# EAGLE design seismometer_sensormodule (EAGLE 7.0.0)
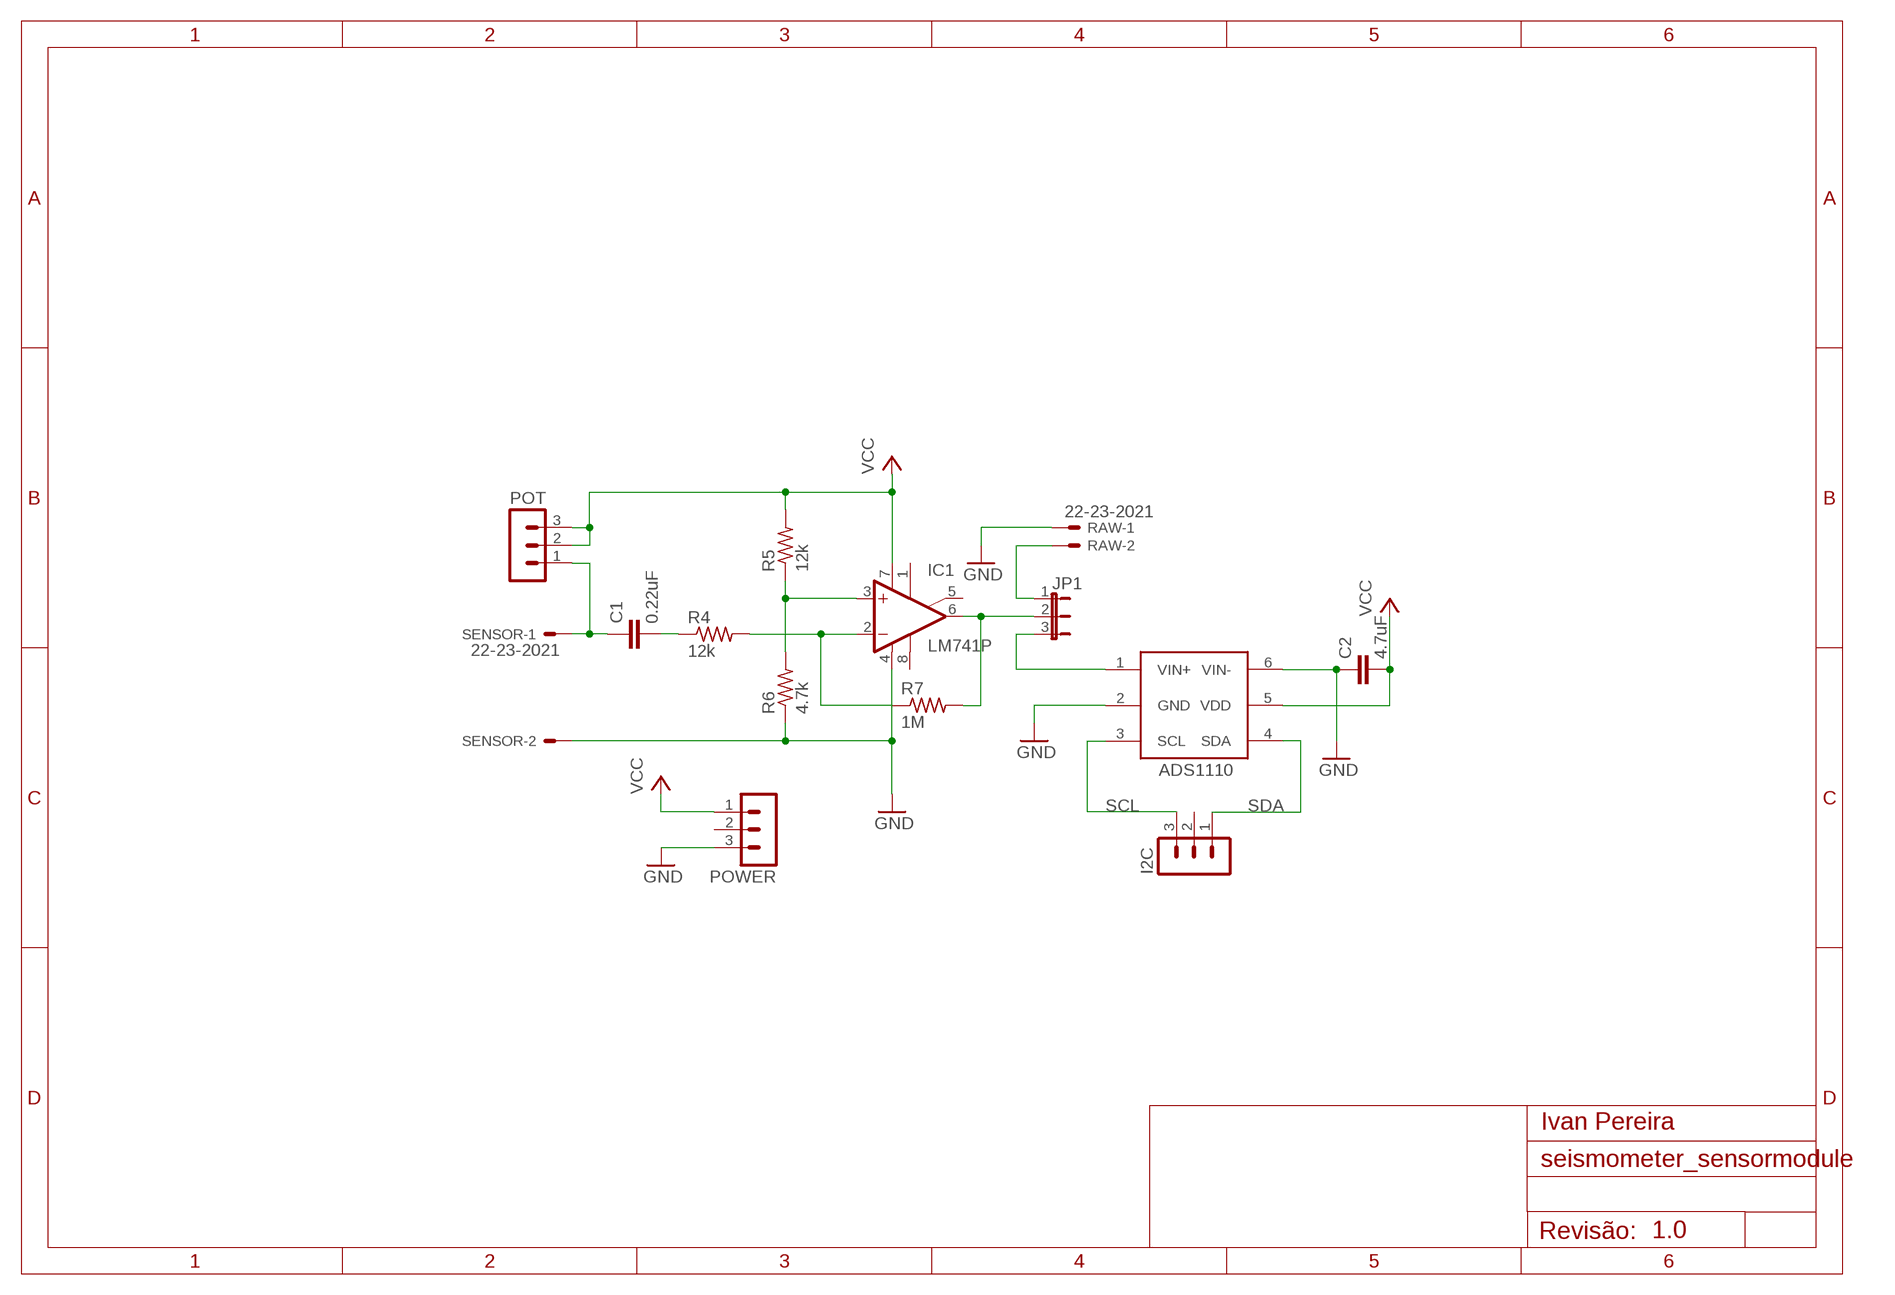
[diagram p0: schematic, sheet 1]
FRAME1 (A4L-LOC): AUTHOR: Ivan Pereira; REV: 1.0

## Parts
C1  0.22uF  C-EU025-030X050  [C025-030X050]
C2  4.7uF  C-EU025-030X050  [C025-030X050]
I2C  MA03-1  [MA03-1]
IC1  LM741P  [DIL08]
IC2  ADS1110  [SOT-23-6]
JP1  JP2E  [JP2]
POT  MA03-1  [MA03-1]
POWER  MA03-1  [MA03-1]
R4  12k  R-US_0207/12  [0207/12]
R5  12k  R-US_0207/12  [0207/12]
R6  4.7k  R-US_0207/12  [0207/12]
R7  1M  R-US_0207/12  [0207/12]
RAW  22-23-2021  [22-23-2021]
SENSOR  22-23-2021  [22-23-2021]

## Nets
GND: C2.1 IC1.4(V-) IC2.2(GND) IC2.6(VIN-) POWER.3 R6.1 RAW.1 SENSOR.2
N$1: IC2.1(VIN+) JP1.3
N$2: C1.2 R4.1
N$3: IC1.2(-IN) R4.2 R7.1
N$4: JP1.1 RAW.2
N$5: IC1.3(+IN) R5.1 R6.2
N$8: C1.1 POT.1 SENSOR.1
N$9: IC1.6(OUT) JP1.2 R7.2
SCL: I2C.3 IC2.3(SCL)
SDA: I2C.1 IC2.4(SDA)
VCC: C2.2 IC1.7(V+) IC2.5(VDD) POT.2 POT.3 POWER.1 R5.2
Unconnected: I2C.2 IC1.1(ON1) IC1.5(ON2) IC1.8(OPT) POWER.2

## Library data of the parts
C1 C2 = rcl:C-EU: CAPACITOR, European symbol
I2C POT POWER = con-lstb:MA03-1: PIN HEADER; OC_FARNELL: unknown; OC_NEWARK: unknown
IC1 = linear:*741: OP AMP
IC2 = ads11xx:ADS1110: Analog/Digital conventer i2c Bus max: 2.048v
JP1 = jumper:JP2E: JUMPER
R4-R7 = resistor:R-US_: RESISTOR, American symbol
RAW SENSOR = con-molex:22-23-2021: .100" (2.54mm) Center Header - 2 Pin; MF: MOLEX; MPN: 22-23-2021; OC_FARNELL: 1462926; OC_NEWARK: 25C3832

## Board
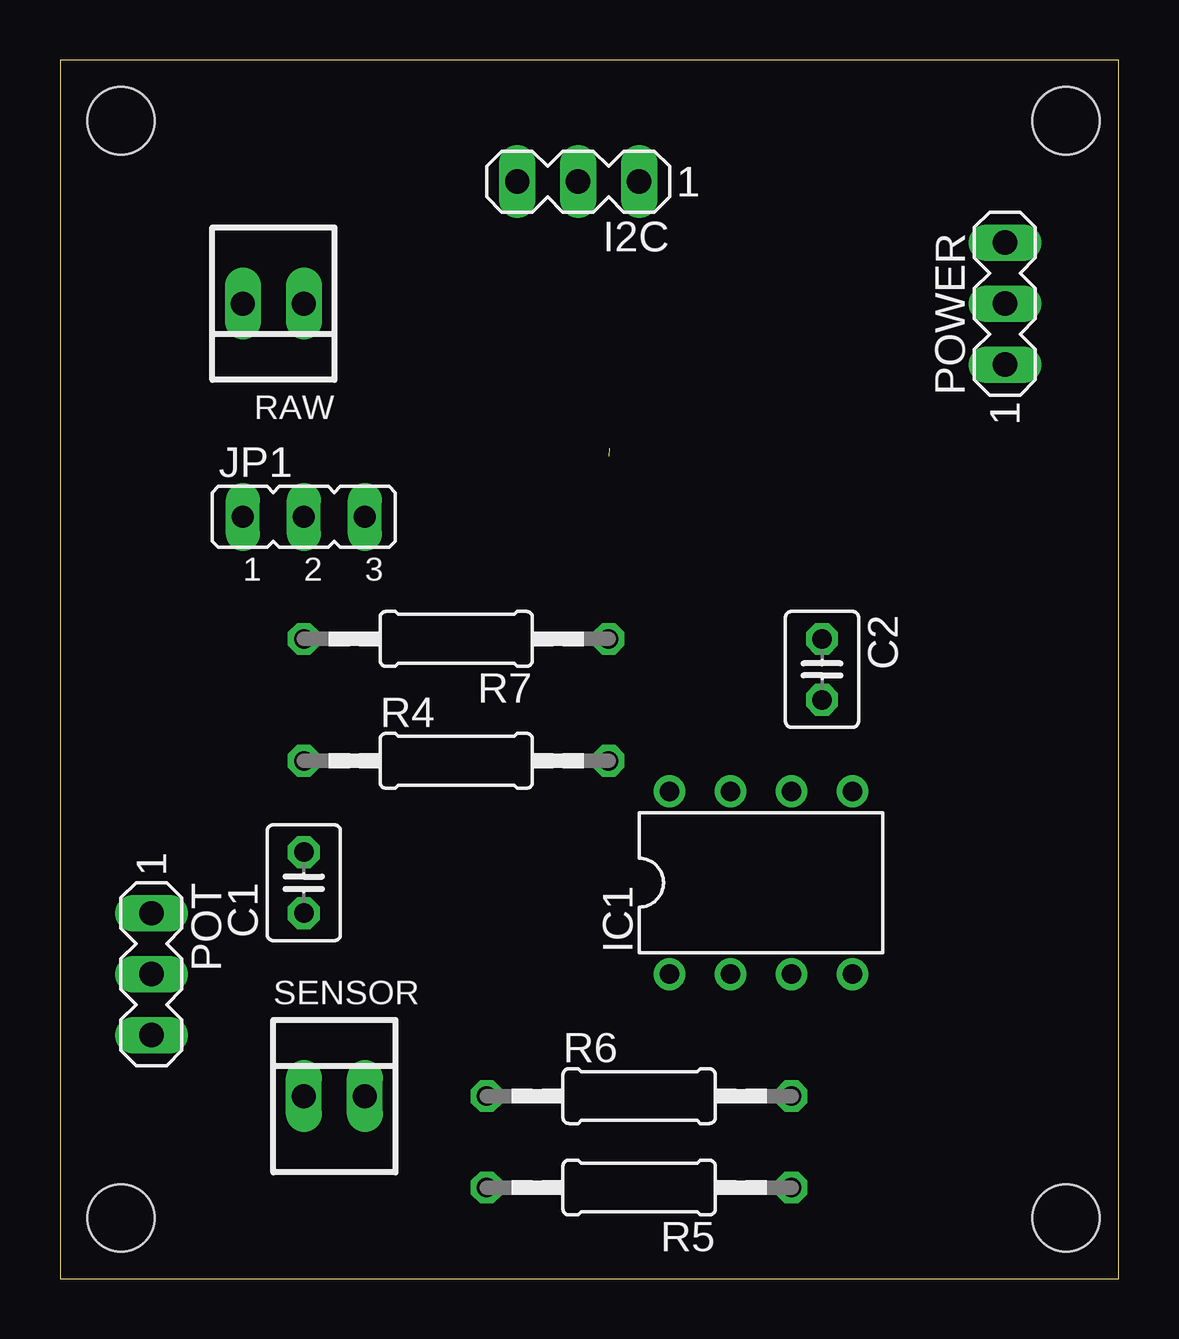
[diagram p1: board, top side]
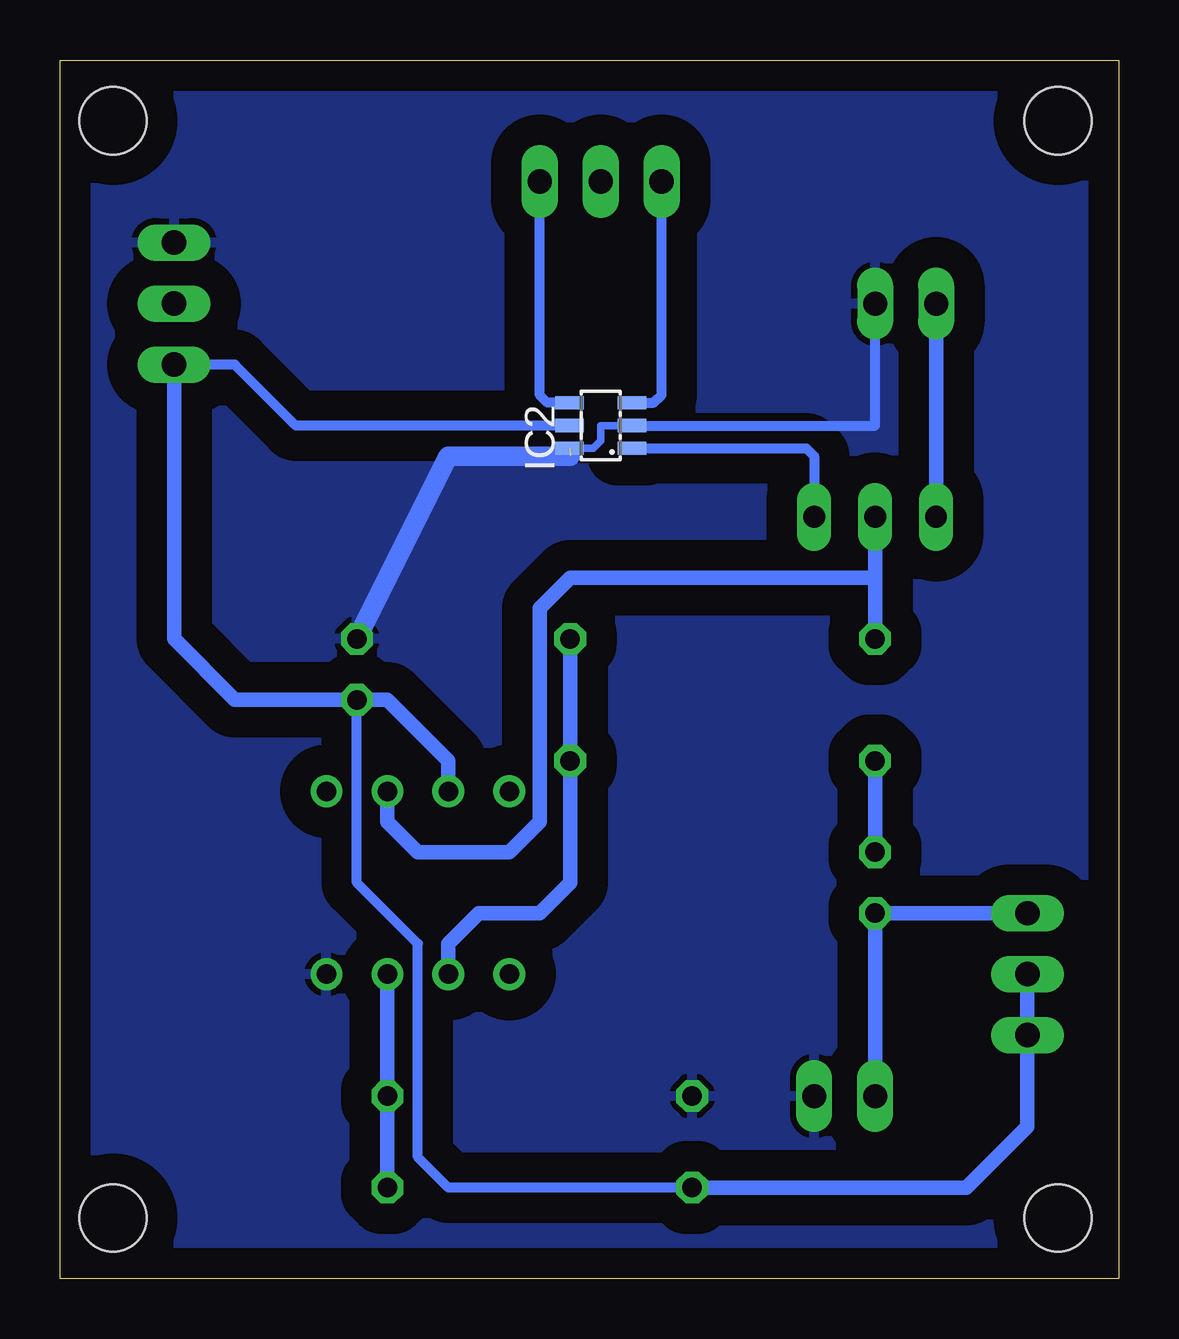
[diagram p2: board, bottom side, seen from below]

Size 44.12 x 50.79 mm. Coordinates in mm from the lower left corner, seen from the top.
Outline: 0,0 44.12,0 44.12,50.79 0,50.79 0,0
Copper layers (1*16): Top 0.035mm / dielectric 1.5mm / Bottom 0.035mm
Design rules "default": minimum track width 10mil, minimum drill 24mil, track to track 8mil, track to pad 8mil, pad to pad 8mil, via to via 8mil, smd to smd 8mil, copper to edge 40mil, drill to drill 8mil, minimum pad ring 10mil, minimum via ring 8mil, stop-mask expansion 4mil, vias tented up to drill 0mil, thermal gap 10mil
Holes 2.8 mm at 2.54,2.54 41.91,2.54 41.91,48.26 2.54,48.26

### Footprints (pad centres in the part's own frame; a part is rotated, then mirrored left to right if it is on the bottom)
C025-030X050 = drill 0.813 octagon: 1 -1.27,0; 2 1.27,0
MA03-1 = drill 1.016 long: 1 -2.54,0; 2 0,0; 3 2.54,0
DIL08 = drill 0.813 pad 1.27: 1 -3.81,-3.81; 2 -1.27,-3.81; 3 1.27,-3.81; 4 3.81,-3.81; 5 3.81,3.81; 6 1.27,3.81; 7 -1.27,3.81; 8 -3.81,3.81
SOT-23-6 = smd 0.55 x 1.2: 1 -0.95,-1.3; 2 0,-1.3; 3 0.95,-1.3; 4 0.95,1.3; 5 0,1.3; 6 -0.95,1.3
JP2 = drill 0.914 long: 1 -2.54,0; 2 0,0; 3 2.54,0
0207/12 = drill 0.813 octagon: 1 -6.35,0; 2 6.35,0
22-23-2021 = drill 1 long: 1 -1.27,0; 2 1.27,0

### Placement (x,y rotation side)
C1  10.16,16.51 90 top
C2  31.75,25.4 270 top
I2C  21.59,45.72 180 top
IC1  29.21,16.51 0 top
IC2  21.59,35.56 90 bottom
JP1  10.16,31.75 0 top
POT  3.81,12.7 270 top
POWER  39.37,40.64 90 top
R4  16.51,21.59 0 top
R5  24.13,3.81 180 top
R6  24.13,7.62 0 top
R7  16.51,26.67 180 top
RAW  8.89,40.64 180 top
SENSOR  11.43,7.62 0 top

### Tracks (layer width: path | path; a pad name or v marks a point on that pad's centre or on a via)
GND  (1 unrouted)
  Bottom 0.305: IC2.6 21.91,34.61 21.59,34.92 21.59,35.56 IC2.2
  Bottom 0.406: IC2.2 10.16,35.56 RAW.1
  Bottom 0.813: C2.1 27.94,34.29 22.86,34.29
  pour Bottom (isolate 1.27): 1.27,1.27 1.27,49.53 43.18,49.53 43.18,1.27
N$1
  Bottom 0.406: IC2.1 13.02,34.61 12.7,34.29 JP1.3
N$2
  Bottom 0.61: C1.2 R4.1
N$3
  Bottom 0.61: R7.1 R4.2 22.86,16.51 24.13,15.24 26.67,15.24 27.94,13.97 IC1.2
N$4
  Bottom 0.61: JP1.1 RAW.2
N$5
  Bottom 0.61: IC1.3 R6.2 R5.1
N$8
  Bottom 0.61: SENSOR.1 C1.1 POT.1
N$9
  Bottom 0.61: JP1.2 10.16,29.21 | 10.16,29.21 R7.2 | IC1.6 30.48,19.05 29.21,17.78 25.4,17.78 24.13,19.05 24.13,27.94 22.86,29.21 10.16,29.21
SCL
  Bottom 0.406: IC2.3 19.37,36.51 19.05,36.83 I2C.3
SDA
  Bottom 0.406: IC2.4 23.81,36.51 24.13,36.83 I2C.1
VCC
  Bottom 0.406: IC2.5 34.29,35.56 36.83,38.1 POWER.1 | R5.2 27.94,3.81 29.21,5.08 29.21,13.97 31.75,16.51 C2.2
  Bottom 0.61: POT.2 POT.3 3.81,6.35 6.35,3.81 R5.2 | POWER.1 39.37,26.67 36.83,24.13 C2.2 30.48,24.13 27.94,21.59 IC1.7